# EAGLE design Light_node (EAGLE 7.5.0)
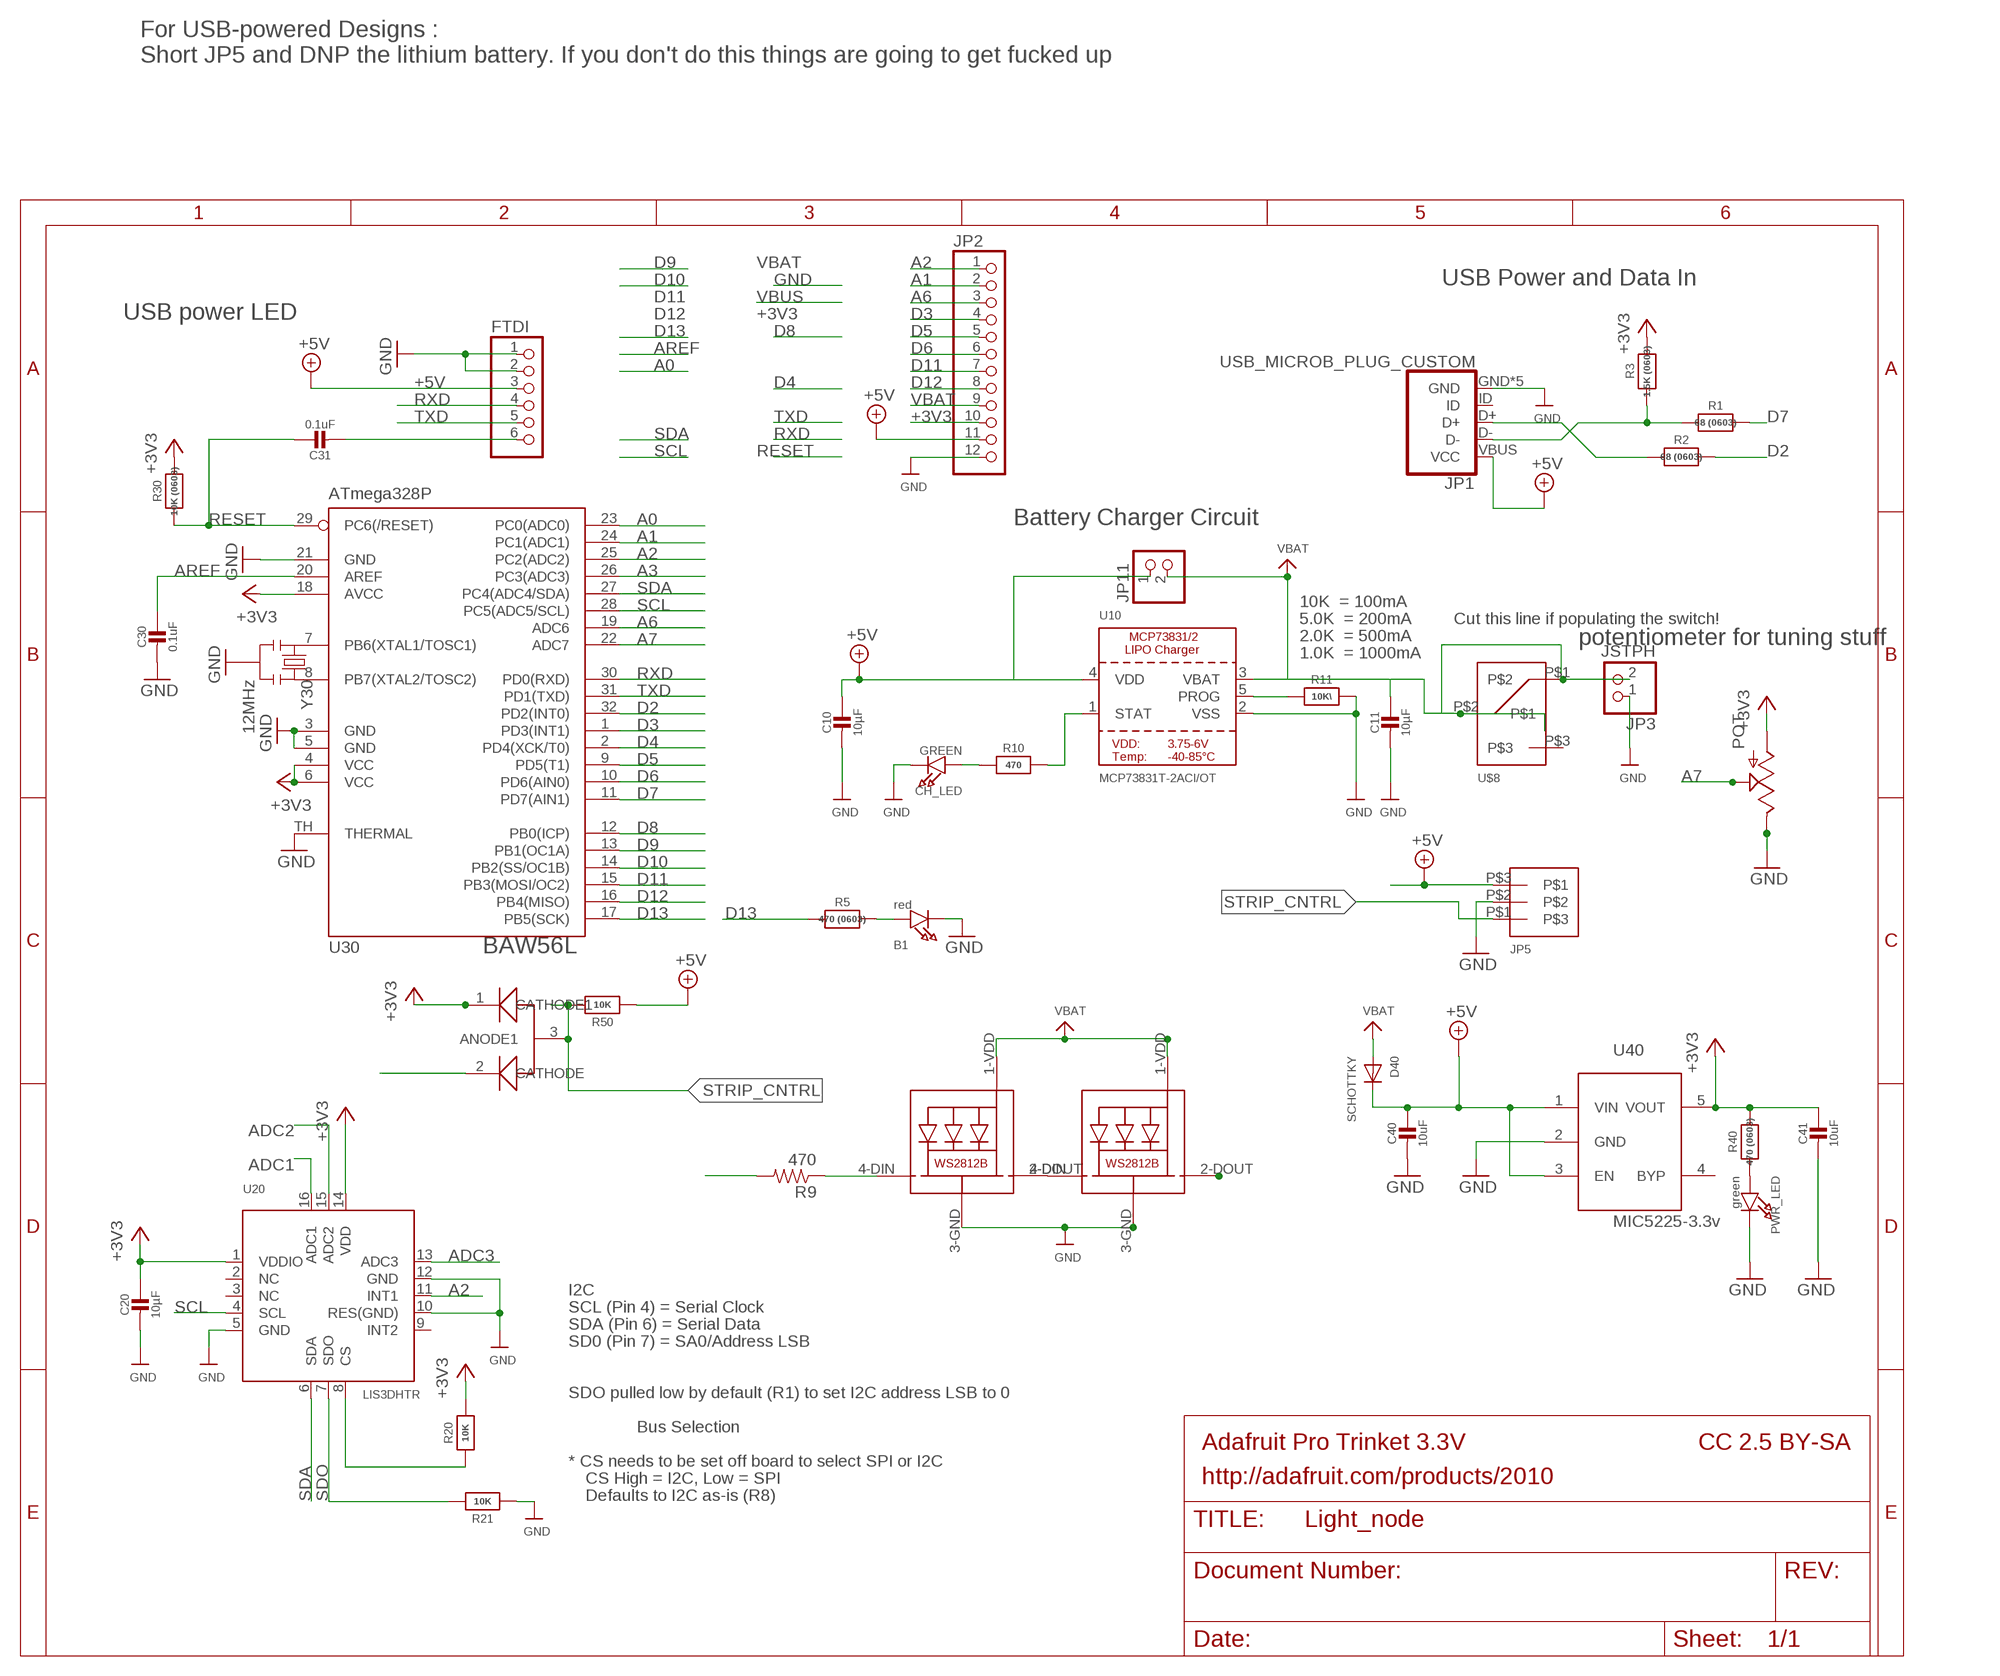
[diagram p0: schematic, sheet 1]

## Parts
B1  red  LED0805_NOOUTLINE  [CHIPLED_0805_NOOUTLINE]
C10  10µF  CAP_CERAMIC0805-NOOUTLINE  [0805-NO]
C11  10µF  CAP_CERAMIC0805-NOOUTLINE  [0805-NO]
C20  10µF  CAP_CERAMIC0805-NOOUTLINE  [0805-NO]
C30  0.1uF  CAP_CERAMIC_0805MP  [_0805MP]
C31  0.1uF  CAP_CERAMIC0805-NOOUTLINE  [0805-NO]
C40  10uF  CAP_CERAMIC0805-NOOUTLINE  [0805-NO]
C41  10uF  CAP_CERAMIC0805-NOOUTLINE  [0805-NO]
CH_LED  GREEN  LED0805_NOOUTLINE  [CHIPLED_0805_NOOUTLINE]
D40  SCHOTTKY  DIODE_SOD-123FL  [SOD-123FL]
FTDI  PINHD-1X6CB  [1X06-CLEANBIG]
JP1  USB_MICROB_PLUG_CUSTOM  [USB-MICROB]
JP2  PINHD-1X12-CB  [1X12-CB]
JP3  JSTPH  JST_2PIN  [JSTPH2]
JP5  M03  [M03_25MM]
JP11  HEADER-1X2ROUND  [1X02_ROUND]
POT  POT  [3306P_POT]
PWR_LED  green  LED0805_NOOUTLINE  [CHIPLED_0805_NOOUTLINE]
R1  68 (0603)  RESISTOR_0603_NOOUT  [0603-NO]
R2  68 (0603)  RESISTOR_0603_NOOUT  [0603-NO]
R3  1.5K (0603)  RESISTOR_0603_NOOUT  [0603-NO]
R5  470 (0603)  RESISTOR_0603_NOOUT  [0603-NO]
R9  470  RESISTOR0603-RES  [0603-RES]
R10  470  RESISTOR0805_NOOUTLINE  [0805-NO]
R11  10K\  RESISTOR0805_NOOUTLINE  [0805-NO]
R20  10K  RESISTOR0805_NOOUTLINE  [0805-NO]
R21  10K  RESISTOR0805_NOOUTLINE  [0805-NO]
R30  10K (0603)  RESISTOR0805_NOOUTLINE  [0805-NO]
R40  470 (0603)  RESISTOR_0603_NOOUT  [0603-NO]
R50  10K  RESISTOR_0603_NOOUT  [0603-NO]
RGB1  WS2812B5050  [WS2812B]
RGB2  WS2812B5050  [WS2812B]
U10  MCP73831T-2ACI/OT  MCP73831/2  [SOT23-5]
U20  LIS3DHTR  ACCEL_LIS3DHTR  [LGA16_3X3MM]
U30  ATmega328P  MEGA8-MI  [MLF32-TH]
U40  MIC5225-3.3v  LP298XS  [SOT23-5L]
U50  COMMON_ANODE_DIODE  [SOT23]
U$8  SPDT_NO_GNDSMT  [JS102011SAQN]
Y30  12MHz  RESONATORSMD  [RESONATOR-SMD]

## Nets
+3V3 [power]: C20.1 C41.1 JP2.10 POT.P$1(A) R3.2 R20.2 R30.2 R40.2 U20.1(VDDIO) U20.14(VDD) U30.4(VCC) U30.6(VCC) U30.18(AVCC) U40.5(VOUT) U50.1(CATHODE1)
+5V: C10.1 C40.1 D40.C FTDI.3 JP1.VBUS(VCC) JP2.11 JP5.P$3 JP11.1 R50.1 U10.4(VDD) U40.1(VIN) U40.3(EN)
A0: U30.23(PC0(ADC0))
A1: JP2.2 U30.24(PC1(ADC1))
A2: JP2.1 U20.11(INT1) U30.25(PC2(ADC2))
A3: U30.26(PC3(ADC3))
A6: JP2.3 U30.19(ADC6)
A7: POT.P$3(S) U30.22(ADC7)
ADC1: U20.16(ADC1)
ADC2: U20.15(ADC2)
ADC3: U20.13(ADC3)
AREF: C30.1 U30.20(AREF)
CS: R20.1 U20.8(CS)
D2: R2.2 U30.32(PD2(INT0))
D3: JP2.4 U30.1(PD3(INT1))
D4: U30.2(PD4(XCK/T0)) U50.2(CATHODE)
D5: JP2.5 U30.9(PD5(T1))
D6: JP2.6 U30.10(PD6(AIN0))
D7: R1.2 U30.11(PD7(AIN1))
D8: U30.12(PB0(ICP))
D9: U30.13(PB1(OC1A))
D10: R9.2 U30.14(PB2(SS/OC1B))
D11: JP2.7 U30.15(PB3(MOSI/OC2))
D12: JP2.8 U30.16(PB4(MISO))
D13: R5.2 U30.17(PB5(SCK))
D+: JP1.D+ R2.1
D-: JP1.D- R1.1 R3.1
DTR/RTS: C31.2 FTDI.6
GND [power]: B1.C C10.2 C11.2 C20.2 C30.2 C40.2 C41.2 CH_LED.C FTDI.1 FTDI.2 JP1.GND JP1.P$1(GND) JP1.P$2(GND) JP1.P$3(GND) JP1.P$4(GND) JP2.12 JP3.1 JP5.P$2 POT.P$2(E) PWR_LED.C R11.2 R21.1 RGB1.3-GND(GND) RGB2.3-GND(GND) U10.2(VSS) U20.5(GND) U20.10(RES(GND)) U20.12(GND) U30.3(GND) U30.5(GND) U30.21(GND) U30.TH(THERMAL) U40.2(GND) Y30.2
LED_CNTRL: R9.1 RGB1.4-DIN(DI)
N$1: B1.A R5.1
N$2: U30.8(PB7(XTAL2/TOSC2)) Y30.3
N$3: U30.7(PB6(XTAL1/TOSC1)) Y30.1
N$4: RGB1.2-DOUT(DO) RGB2.4-DIN(DI)
N$5: R10.2 U10.1(STAT)
N$6: PWR_LED.A R40.1
N$8: R11.1 U10.5(PROG)
N$9: CH_LED.A R10.1
N$15: RGB2.2-DOUT(DO)
RESET: C31.1 R30.1 U30.29(PC6(/RESET))
RXD: FTDI.4 U30.30(PD0(RXD))
SCL: U20.4(SCL) U30.28(PC5(ADC5/SCL))
SDA: U20.6(SDA) U30.27(PC4(ADC4/SDA))
SDO: R21.2 U20.7(SDO)
STRIP_CNTRL: JP5.P$1 R50.2 U50.3(ANODE1)
TXD: FTDI.5 U30.31(PD1(TXD))
VBAT [power]: C11.1 D40.A JP2.9 JP3.2 JP11.2 RGB1.1-VDD(VDD) RGB2.1-VDD(VDD) U10.3(VBAT) U$8.P$1 U$8.P$2
Unconnected: JP1.ID U20.2(NC) U20.3(NC) U20.9(INT2) U40.4(BYP) U$8.P$3

## Notes on the sheet
- For USB-powered Designs : 
  Short JP5 and DNP the lithium battery. If you don't do this things are going to get fucked up
- USB Power and Data In
- USB power LED
- Battery Charger Circuit
- 10K  = 100mA
- 5.0K  = 200mA | Cut this line if populating the switch!
- 2.0K  = 500mA | potentiometer for tuning stuff
- 1.0K  = 1000mA
- BAW56L
- I2C
- SCL (Pin 4) = Serial Clock
- SDA (Pin 6) = Serial Data
- SD0 (Pin 7) = SA0/Address LSB
- SDO pulled low by default (R1) to set I2C address LSB to 0
- Bus Selection
- Adafruit Pro Trinket 3.3V | CC 2.5 BY-SA
- * CS needs to be set off board to select SPI or I2C
- CS High = I2C, Low = SPI | http://adafruit.com/products/2010
- Defaults to I2C as-is (R8)

## Library data of the parts
B1 CH_LED PWR_LED = microbuilder:LED: LED 0603 - 0603 Surface Mount Package 2mA: Green LED - Low Power (3.9mcd, 2ma, 1.7Vf) - Digikey: 475-2709-2-ND Orange LED - Low Power (9.8mcd, 2ma, 1.8Vf) - Digikey: 475-1194-2-ND Red LED - Low Power (5mcd, 2ma, 1.8Vf) - Digikey: 475-1195-2-ND Yellow LED - Low Power (7mcd, 2ma, 1.8Vf) - Digikey: 475-1196-2-ND 5mA: Blue LED - Low Power (17mcd, 5ma, 2.9Vf) - Digikey: LNJ937W8CRACT-ND 0805 - 0805 Surface Mount Package 2mA: Red LED (8.8mcd, 2mA, 1.8Vf, Clear) - Low Power [Digikey: 475-2510-1-ND] Green LED (5mcd, 2mA, 1.8Vf, Clear) - Low Power [Digikey: 475-2730-1-ND] Yellow LED (11.3mcd, 2mA, 1.8Vf, Clear) - Low Power [Digikey: 475-2555-1-ND] 20mA: Red LED (104mcd, 20mA, Diffused) - LS R976 [Digikey: 475-1278-6-ND] Red LED (12mcd, 20mA, 2.0Vf, Clear) - APT2012EC [Digikey: 754-1128-1-ND] Green LED (15mcd, 20mA, 2.2Vf, Clear) - APT2012GC [Digikey: 754-1131-1-ND] Orange LED (160mcd, 20mA, 2.1Vf, Clear) - APT2012SECK [Digikey: 754-1130-1-ND] 1206 - 1206 Surface Mount Package Green LED (26mcd, 20mA, Diffused) - LG N971 [Digikey: 475-1407-6-ND] Red LED (15mcd, 20mA, Diffused) - LH N974 [Digikey: 475-1416-6-ND] Cree - Cree High-Power Surface Mount LEDs XPEBWT-L1-0000-00D50 - White 111lm 350mA 2.9Vf 6200K 110° XTEAWT-00-0000-00000LEE3 - White 114lm 350mA 2.85Vf 5000K 115° Everlight - Everlight 45-21 Series Surface Mount LEDs 45-21/QK2C-B2832AC2CB2/2T - Warm White 2000mcd 20mA 3.25Vf 3050K 120° 45-21/LK2C-B38452C4CB2/2T - Nuetral White 2000mcd 20mA 3.25Vf 4150K 120° 45-21/LK2C-B50634C6CB2/2T - Cold White 2200mcd 20mA 3.25Vf 5650K 120° PLCC2 Reverse Mount LS T77K-J1L2-1-0-2-R18-Z - Red 11.25mcd 2mA 1.8Vf 630nm 120° LO T77K-L1M2-24-Z - Orange 19.6mcd 2mA 1.8Vf 606nm 120° LY T77K-K2M1-26-Z - Yellow 15.7mcd 2mA 1.8Vf 587nm 120°
C10 C11 C20 C30 C31 C40 C41 = microbuilder:CAP_CERAMIC: Ceramic Capacitors For new designs, use the packages preceded by an '_' character since they are more reliable: The following footprints should be used on most boards: _0402 - Standard footprint for regular board layouts _0603 - Standard footprint for regular board layouts _0805 - Standard footprint for regular board layouts _1206 - Standard footprint for regular board layouts For extremely tight-pitch boards where space is at a premium, the following 'micro-pitch' footprints can be used (smaller pads, no silkscreen outline, etc.): _0402MP - Micro-pitch footprint for very dense/compact boards _0603MP - Micro-pitch footprint for very dense/compact boards _0805MP - Micro-pitch footprint for very dense/compact boards _1206MP - Micro-pitch footprint for very dense/compact boards
D40 = adafruit:DIODE: Diode SMADIODE - SMA Surface Mount Package 20V 1A Schottky Diode Digikey: 641-1014-6-ND DO-1N4148 - Through Hole Small Current Diode SOD-123 20V 1 A (.5mV Vf) Schottky Diode - Digikey: MBRX120TPMSCT-ND SOD-323 10V 570mA (.38mV Vf, 3ns) Schottky Diode - Digikey: ZLLS410CT-ND SOD-523 30V 30mA Schottky Diode (RB751S-40TE61) - Digikey: RB751S-40TE61CT-ND SOT23-R/W - SOT23 Package (R = Solder Paste/Reflow Ovens, W = Hand-Soldering) BAT54Film 40V 300mA - Digikey: 497-7162-1-ND
FTDI = adafruit:PINHD-1X6: PIN HEADER
JP1 = 0_AlpineLabs:USB_MICROB_PLUG: USB Micro-B Plug Comes in a variety of packages. Check out Hirose's ZX-x0 line: http://www.hirose.co.jp/cataloge_hp/e24200011.pdf
JP2 = adafruit:PINHD-1X12: PIN HEADER
JP3 = microbuilder:JST_2PIN: JST 2-Pin Right-Angle Connector PH-Series - 4UConnector: 17311 SH-Series - 4UConnector: 07278
JP5 = 0_Shibbs1:M03
JP11 = microbuilder:HEADER-1X2: PIN HEADER
POT = 0_Shibbs1:POT
R1-R3 R5 R10 R11 R20 R21 R30 R40 R50 = microbuilder:RESISTOR: Resistors For new designs, use the packages preceded by an '_' character since they are more reliable: The following footprints should be used on most boards: _0402 - Standard footprint for regular board layouts _0603 - Standard footprint for regular board layouts _0805 - Standard footprint for regular board layouts _1206 - Standard footprint for regular board layouts For extremely tight-pitch boards where space is at a premium, the following 'micro-pitch' footprints can be used (smaller pads, no silkscreen outline, etc.): _0402MP - Micro-pitch footprint for very dense/compact boards _0603MP - Micro-pitch footprint for very dense/compact boards _0805MP - Micro-pitch footprint for very dense/compact boards _1206MP - Micro-pitch footprint for very dense/compact boards
R9 = 0_shibbs2:RESISTOR: Resistor Basic schematic elements and footprints for 0603, 1206, and PTH resistors.
RGB1 RGB2 = microbuilder:WS2812B5050
U10 = microbuilder:MCP73831/2: MCP73831/2 LIPO Charger VDD: 3.75 - 6V Temp -40 - 85°C Programmable Charge Rate: 15-500mA NOTE: STAT is a tri-state logic output on the MCP73831 and an open-drain output on the MCP73832. SOT23-5 with 4.2V output and tri-state logic on STAT = MCP73831T-2ACI/OT
U20 = microbuilder:ACCEL_LIS3DHTR: LIS3DHTR 3-Axis Accelerometer with I2C/SPI Interface VDD: 1.71-3.6V VDDIO: 1.71-VDD+0.1V Scale: +/-2g, 4g, 8g, 16g with 16--bit data output Temp:: -40°C - 85°C Mouser: 511-LIS3DHTR Digikey: 497-10613-1-ND
U30 = microbuilder:MEGA8-MI: MICROCONTROLLER 8 Kbytes FLASH, 1 kbytes SRAM, 512 bytes EEPROM, USART, 6-channel 10 bit ADC, 2-channel 8 bit ADC Pin compatible with Atmega48, ATMega88, ATMega168 Source: avr.lbr; MPN: ATMEGA88PA-MU; OC_FARNELL: 1715491; OC_NEWARK: 15R0272
U40 = adafruit:LP298X
U50 = 0_AlpineLabs:COMMON_ANODE_DIODE
U$8 = 0_Shibbs1:SPDT_NO_GND
Y30 = SparkFun:RESONATOR: Resonator Small SMD resonator. This is the itty bitty 10/20MHz resonators with built in caps. CSTCE10M0G55 and CSTCE20M0V53. Footprint has been reviewed closely but hasn't been tested yet.

## Net classes
1 power: width 0.305 mm

## Board
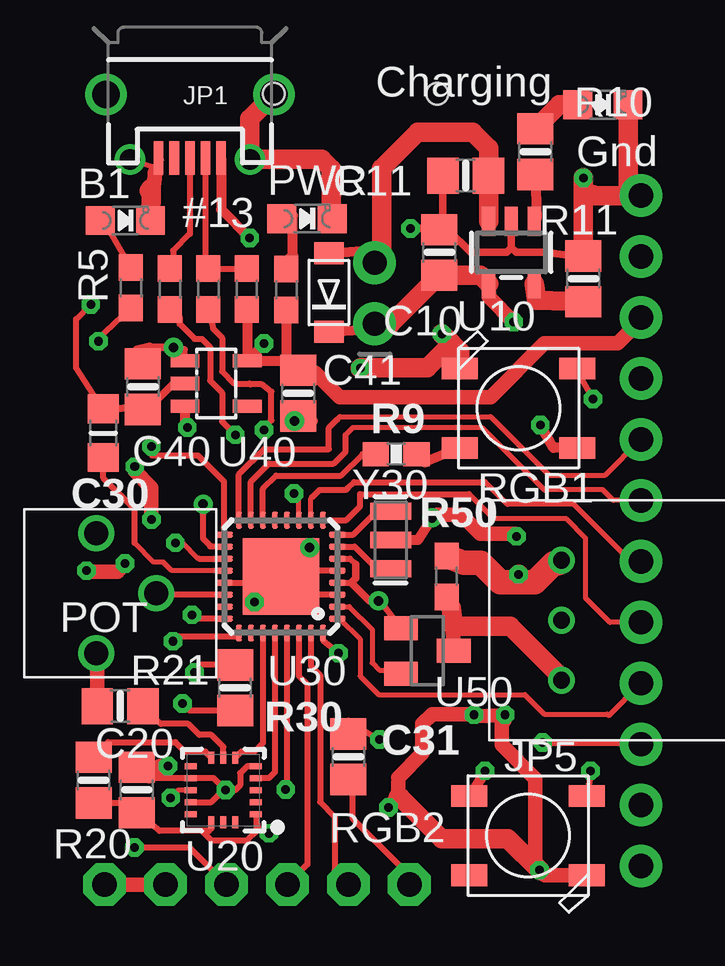
[diagram p1: board, top side]
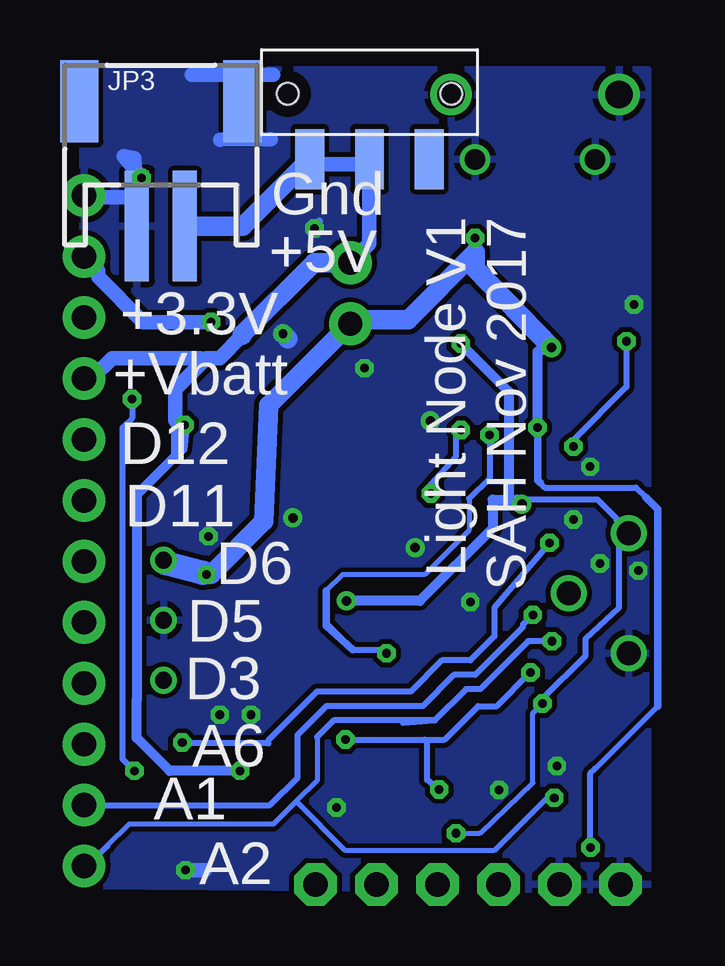
[diagram p2: board, bottom side, seen from below]

No outline drawn. Coordinates in mm, seen from the top.
Copper layers (1*16): Top 0.0178mm / dielectric 59mil / Bottom 0.0178mm
Design rules "SSC-EAGLE-2Lyr_v1.0.0.3 *": minimum track width 6mil, minimum drill 14mil, track to track 8mil, track to pad 8mil, pad to pad 8mil, via to via 8mil, smd to smd 6mil, copper to edge 20mil, drill to drill 16mil, minimum pad ring 8mil, minimum via ring 8mil, stop-mask expansion 3mil, vias tented up to drill 0mil, thermal gap 10mil

### Footprints (pad centres in the part's own frame; a part is rotated, then mirrored left to right if it is on the bottom)
CHIPLED_0805_NOOUTLINE = smd 1.2 x 1.2: A 0,-1.05; C 0,1.05
0805-NO = smd 1.3 x 1.5: 1 -0.95,0; 2 0.95,0
_0805MP = smd 1.2 x 1.3: 1 -1.016,0; 2 1.016,0
SOD-123FL = smd 0.91 x 1.22: A 1.637,0; C -1.637,0
1X06-CLEANBIG = drill 1.016 pad 1.778 octagon: 1 -6.35,0; 2 -3.81,0; 3 -1.27,0; 4 1.27,0; 5 3.81,0; 6 6.35,0
USB-MICROB = smd 0.4 x 1.4: D+ 0,2.65; D- -0.65,2.65; GND 1.3,2.65; ID 0.65,2.65; VBUS -1.3,2.65 | drill 1.15 pad 1.201: P$1 -3.5,0; P$2 3.5,0 | drill 0.85 pad 0.914: P$3 -2.5,2.7; P$4 2.5,2.7
1X12-CB = drill 1.016 pad 1.778: 1 -13.97,0; 2 -11.43,0; 3 -8.89,0; 4 -6.35,0; 5 -3.81,0; 6 -1.27,0; 7 1.27,0; 8 3.81,0; 9 6.35,0; 10 8.89,0; 11 11.43,0; 12 13.97,0
JSTPH2 = smd 1 x 4.6: 1 -1,-3.7; 2 1,-3.7 | smd 1.6 x 3.4: NC1 -3.4,1.5; NC2 3.4,1.5
M03_25MM = drill 0.7: P$1 0,-2.5; P$2 0,0; P$3 0,2.5
1X02_ROUND = drill 1 pad 1.778: 1 -1.27,0; 2 1.27,0
3306P_POT = drill 1: P$1 -2.5,0; P$2 2.5,0; P$3 0,2.5
0603-NO = smd 1.1 x 1: 1 -0.85,0; 2 0.85,0
0603-RES = smd 1.1 x 1: 1 -0.85,0; 2 0.85,0
WS2812B = smd 1.5 x 0.9: 1-VDD 2.45,-1.65; 2-DOUT 2.45,1.65; 3-GND -2.45,1.65; 4-DIN -2.45,-1.65
SOT23-5 = smd 0.55 x 1.2: 1 -0.95,-1.3; 2 0,-1.3; 3 0.95,-1.3; 4 0.95,1.3; 5 -0.95,1.3
LGA16_3X3MM = smd 0.5 x 0.25: 1 -1.35,1; 2 -1.35,0.5; 3 -1.35,0; 4 -1.35,-0.5; 5 -1.35,-1; 9 1.35,-1; 10 1.35,-0.5; 11 1.35,0; 12 1.35,0.5; 13 1.35,1 | smd 0.25 x 0.5: 6 -0.5,-1.35; 7 0,-1.35; 8 0.5,-1.35; 14 0.5,1.35; 15 0,1.35; 16 -0.5,1.35
MLF32-TH = smd 0.7 x 0.25: 1 -2.35,1.75; 2 -2.35,1.25; 3 -2.35,0.75; 4 -2.35,0.25; 5 -2.35,-0.25; 6 -2.35,-0.75; 7 -2.35,-1.25; 8 -2.35,-1.75; 17 2.35,-1.75; 18 2.35,-1.25; 19 2.35,-0.75; 20 2.35,-0.25; 21 2.35,0.25; 22 2.35,0.75; 23 2.35,1.25; 24 2.35,1.75 | smd 0.25 x 0.7: 9 -1.75,-2.35; 10 -1.25,-2.35; 11 -0.75,-2.35; 12 -0.25,-2.35; 13 0.25,-2.35; 14 0.75,-2.35; 15 1.25,-2.35; 16 1.75,-2.35; 25 1.75,2.35; 26 1.25,2.35; 27 0.75,2.35; 28 0.25,2.35; 29 -0.25,2.35; 30 -0.75,2.35; 31 -1.25,2.35; 32 -1.75,2.35 | smd 3.2 x 3.2: TH 0,0
SOT23-5L = smd 0.55 x 1.2: 1 -0.95,-1.3; 2 0,-1.3; 3 0.95,-1.3; 4 0.95,1.3; 5 -0.95,1.3
SOT23 = smd 1 x 1.4: 1 -0.95,-1.1; 2 0.95,-1.1; 3 0,1.1
JS102011SAQN = smd 1.2 x 2.5: P$1 2.489,2.794; P$2 0,2.794; P$3 -2.489,2.794 | hole 0.889: 3.404,0.064; -3.404,0.064
RESONATOR-SMD = smd 0.7 x 1.7: 1 -1.2,0; 2 0,0; 3 1.2,0

### Placement (x,y rotation side)
B1  3.01,29.15 270 top
C10  16.09,27.82 90 top
C11  17.19,31.02 180 top
C20  3.49,5.43 90 top
C30  2.09,20.3 90 top
C31  12.3,6.81 270 top
C40  3.75,22.23 270 top
C41  10.22,21.96 270 top
CH_LED  22.91,33.98 270 top
D40  11.49,26.15 90 top
FTDI  8.49,1.49 0 top
JP1  5.7,34.4 180 top
JP2  24.49,16.22 90 top
JP3  21.29,32.62 0 bottom
JP5  21.18,12.5 0 top
JP11  13.39,26.12 90 top
POT  1.79,13.62 270 top
PWR_LED  10.58,29.23 270 top
R1  6.47,26.3 270 top
R2  4.87,26.3 270 top
R3  8.06,26.3 270 top
R5  3.24,26.35 270 top
R9  14.29,19.42 180 top
R10  20.09,32.02 270 top
R11  22.09,26.72 90 top
R20  1.69,5.84 270 top
R21  2.79,8.92 0 top
R30  7.58,9.68 270 top
R40  9.72,26.27 270 top
R50  16.39,14.32 270 top
RGB1  19.39,21.33 0 top
RGB2  19.79,3.52 180 top
U10  19.09,27.82 180 top
U20  7.09,5.42 180 top
U30  9.49,14.32 180 top
U40  6.79,22.36 270 top
U50  15.59,11.22 270 top
U$8  12.6,34.5 180 bottom
Y30  14.07,15.84 90 top

### Tracks (layer width: path | path; a pad name or v marks a point on that pad's centre or on a via)
+3V3  (via drill 0.36, 0.39)
  Top 0.203: U20.1 8.54,3.87 v8.99,3.62 | U20.14 6.59,3.82
  Top 0.254: U30.18 6.55,15.57 6.55,15.6 6.25,15.9 v6.25,17.33 | U30.6 12.36,15.07 12.61,14.83 | U30.4 12.41,14.07 12.41,14.06 | R30.2 5.68,8.73 v5.39,9.02 | U50.1 13.89,12.97 v13.56,13.3 | 6.59,3.82 6.49,3.72 6.19,3.72 | 6.19,3.72 4.44,3.72 C20.1 3.08,4.88 R20.2 | 6.19,3.72 6.59,3.32 8.1,3.32 8.48,3.71 8.48,4.38 U20.1
  Top 0.305: 12.61,14.83 12.61,14.26 12.41,14.06 13.18,13.3 v13.56,13.3
  Top 0.406: 8.19,23.41 U40.5 | U40.5 9.69,23.31 | 9.69,23.31 C41.1 | R3.2 8.09,25.41 U40.5 | R40.2 9.72,23.33 9.69,23.31 | v8.79,24.02 8.79,24.01 U40.5
  Top 0.61: JP2.10 24.49,25 23.52,24.03 20.47,24.03 18.24,21.79 11.94,21.79 10.92,22.81 10.31,22.81 C41.1
  Bottom 0.203: v8.99,3.62 7.99,3.62 5.79,5.72 5.79,8.62 v5.39,9.02
  Bottom 0.254: v5.39,9.02 5.39,9.22 3.59,11.02 3.59,11.72 2.19,13.02 2.19,15.62 POT.P$1 2.29,16.62 2.29,16.72 3.09,17.52 6.06,17.52 v6.25,17.33 | 6.44,17.53 6.68,17.53 6.79,17.64
  Bottom 0.406: v8.79,24.02 6.79,22.02 6.79,17.64 | v6.25,17.33 6.44,17.53 7.47,17.53 7.47,16.33 10.5,13.3 v13.55,13.3 v13.56,13.3
+5V  (via drill 0.36, 0.39)
  Top 0.254: U40.1 5.49,23.79 v5.02,23.86 | v3.39,3.02 5.69,3.02 FTDI.3
  Top 0.305: C40.1 3.49,23.43 | 4.01,23.86 v5.02,23.86
  Top 0.406: 3.49,23.43 3.49,23.74 4.01,23.86 | D40.C 13.15,24.61 JP11.1 | U40.3 5.49,20.62 v5.59,20.52 | JP1.VBUS 7,29.62 v8.19,28.42
  Top 0.61: U10.4 18.14,25.97 v19.19,24.92
  Top 0.813: JP11.1 14.07,24.85 C10.1 17.79,26.87 U10.4 | 19.42,13.98 v19.39,14.41 | 21.06,14.87 JP5.P$3
  Top 1.016: 21.06,14.87 20.86,14.87 20.07,14.07 18.64,14.07 17.83,14.88 17.11,14.88 R50.1
  Bottom 0.203: 3.2,6.32 0.59,8.92
  Bottom 0.254: 5.02,24.09 v5.02,23.86 | 5.49,18.22 5.29,18.02 1.5,18.02 1.09,17.61 | v3.39,3.02 3.39,6.12 3.2,6.32
  Bottom 0.305: v5.59,20.52 5.59,18.32 5.49,18.22 | 1.09,17.61 0.59,17.11 0.59,8.92
  Bottom 0.406: v8.19,28.42 8.19,27.82 | 13.22,25.02 JP11.1 | v5.59,20.52 5.59,23.68 v5.02,23.86
  Bottom 0.61: 24.46,27.69 JP2.11 23.9,27.06 23.9,26.8 22.02,24.92 v19.19,24.92
  Bottom 0.813: JP11.1 16.79,21.45 17,16.61 19.2,14.41 v19.39,14.41 19.54,14.47 | 13.22,25.02 10.99,25.02 8.19,27.82 8.19,27.14 v5.02,23.86
  Bottom 1.016: 19.54,14.47 21.06,14.87 JP5.P$3
A1  (via drill 0.36)
  Top 0.254: U30.24 5.95,12.57 v5.79,12.72
  Bottom 0.254: v5.79,12.72 6.19,12.32 6.19,12.22 8.19,10.22 9.08,10.22 10.38,8.92 14.39,8.92 15.59,7.72 15.59,5.94 16.75,4.79 JP2.2
A2  (via drill 0.36)
  Top 0.203: U20.11 5.22,5.42 v4.9,5.1
  Top 0.254: U30.25 7.74,11.81 5.18,11.81 v4.99,11.62
  Bottom 0.203: 14.78,7.63 14.78,5.82 15.65,4.95 | 15.65,4.95 16.6,4 22.62,4 23.52,3.1 | v4.9,5.1 5.2,5.1 7.4,2.9 13.6,2.9 15.65,4.95
  Bottom 0.254: v4.99,11.62 5.99,11.62 7.99,9.62 8.57,9.62 9.87,8.32 | 11.19,8.22 9.87,8.32 | 9.87,8.32 14.09,8.32 14.78,7.63 | JP2.1 24.37,2.25 23.52,3.1
A6  (via drill 0.36)
  Top 0.203: U30.19 6.05,15.07 5.39,15.72 v5.09,15.72
  Top 0.254: 6.08,15.07 U30.19 | v20.4,7.4 24.43,7.4 JP2.3
  Bottom 0.254: v5.09,15.72 7.39,13.02 7.39,11.82 8.39,10.82 9.58,10.82 10.88,9.52 14.79,9.52 16.81,7.5 16.81,7.37 20.07,7.37 v20.4,7.4
A7
  Top 0.254: U30.22 4.35,13.57 POT.P$3
AREF
  Top 0.203: U30.20 4.95,14.57 4.59,14.92 4.19,14.92 3.39,15.72
  Top 0.254: C30.1 2.09,19.08 2.09,18.42 3.39,17.12 3.39,15.72
CS
  Top 0.254: 6.59,6.82 U20.8 6.34,7.02 5.49,7.02 5.09,7.42 2.29,7.42 2.29,7.22 2.19,7.12 2.19,6.47 R20.1
D2  (via drill 0.36)
  Top 0.254: R2.2 5.27,25.15 5.27,24.85 5.89,24.22 6.2,24.22 6.54,23.88 6.54,22.48 7.05,21.98 7.05,20.77 v7.59,20.22 | U30.32 11.24,11.67 v11.89,11.12
  Bottom 0.203: 8.45,17.57 8.45,16.25 10.3,14.4 13.72,14.4 14.39,13.72
  Bottom 0.254: 14.32,12.29 13.3,11.27 12.04,11.27 v11.89,11.12 | v7.59,20.22 7.59,18.42 8.45,17.57
  Bottom 0.305: 14.39,13.72 14.39,12.26 13.3,11.27
D3
  Top 0.203: U30.1 11.95,12.57 12.79,11.72 12.79,10.17 13.56,9.4 19.66,9.4 20.47,8.59 23.08,8.59 23.14,8.52 JP2.4
D4
  Top 0.203: U30.2 12.35,13.07 13.29,12.12 13.29,10.72 13.59,10.42 14.44,10.42 U50.2
D5
  Top 0.203: JP2.5 23.2,12.41 22.19,13.42 22.19,15.92 21.39,16.72 18.36,16.72 17.34,17.75
  Top 0.254: U30.9 12.22,16.67 12.8,17.24 12.8,17.75 17.34,17.75
D6
  Top 0.203: JP2.6 24.06,14.95 21.69,17.32 18.93,17.32 18,18.26 | U30.10 10.74,17.57 10.79,17.62
  Top 0.254: 18,18.26 12.54,18.26 12.29,18 12.27,18 12.19,17.92 11.09,17.92 10.79,17.62
D7  (via drill 0.36)
  Top 0.203: U30.11 10.24,17.57 v10.04,17.77
  Top 0.254: R1.2 6.67,24.64 7.05,24.26 7.05,22.87 7.56,22.36 8.19,22.36 8.23,22.32 8.69,22.32 9.09,22.02 9.09,20.82 v8.79,20.42
  Bottom 0.254: v10.04,17.77 10.04,18.17 8.99,19.32 8.99,20.42 v8.79,20.42
D10
  Top 0.254: U30.14 8.74,17.97 9.29,18.52 11.99,18.52 12.89,19.42 R9.2
D11
  Top 0.203: JP2.7 23.35,17.49 22.91,17.93 20.47,17.93 17.88,20.52 12.49,20.52 12.19,20.22
  Top 0.254: U30.15 8.24,18.27 8.99,19.02 11.69,19.02 12.19,19.52 12.19,20.22
D12
  Top 0.203: 11.84,20.87 11.95,20.98 18.24,20.98 20.67,18.54 23,18.54 JP2.8
  Top 0.254: U30.16 7.74,18.57 8.79,19.62 11.49,19.62 11.49,20.52 11.84,20.87
D13  (via drill 0.36)
  Top 0.254: U30.17 7.14,16.29 7.13,16.29 7.13,18.27 6.04,19.36 4.13,19.36 v4.09,19.73 | R5.2 1.84,24.18 v1.89,24.12
  Bottom 0.254: v1.89,24.12 1.89,22.22 4.09,20.02 v4.09,19.73
D+
  Top 0.254: JP1.D+ 5.7,28.6 5,27.9 5,27.28 R2.1
D-
  Top 0.254: R3.1 R1.1 6.35,27.26 JP1.D-
DTR/RTS
  Top 0.254: FTDI.6 14.84,1.87 12.49,4.22 12.49,5.67 C31.2
GND  (via drill 0.36, 0.39)
  Top 0.203: 4.14,5.92 4.29,5.92 v4.79,6.42 | JP1.P$4 4.3,31.34 4.16,31.2
  Top 0.254: U30.5 9.74,14.57 | U30.3 10.24,13.57 | U30.21 9.24,14.07 | U20.12 6.59,4.92 7.09,5.42 7.09,5.52 | 7.09,5.52 6.69,5.92 U20.10 4.14,5.92 C20.2 | U20.5 8.09,6.42 7.79,6.12 7.79,5.62 7.59,5.42 v7.19,5.42 7.09,5.52 | C30.2 1.86,21.61 0.96,23.01 0.96,25.05 v1.57,25.65
  Top 0.305: 9.24,14.07 v10.69,15.52 | 9.74,14.57 v10.69,15.52 | 10.24,13.57 v10.69,15.52 | C30.2 3.69,21.34 C40.2 4.06,21.6 4.25,21.6 5.02,22.36 U40.2 | U10.2 19.09,28.02 | 19.09,28.02 19.29,27.82 20.49,27.82 21.29,27.72 21.84,27.82 | C10.2 16.44,28.77 17.39,27.82 18.89,27.82 19.09,28.02 | C11.2 16.24,28.92 C10.2 | C10.2 16.09,28.82 v14.89,28.82
  Top 0.406: Y30.2 15.21,15.84 v15.79,16.76 | B1.C 4.16,31.2 | C41.2 10.82,20.8 v10.06,20.8 | JP1.GND 4.3,30.7 4,30.4
  Top 0.61: R21.1 1.84,11.07 POT.P$2 | RGB2.3-GND 20.48,1.87 v20.27,2.08 | v3,14.86 2.93,14.76 2.69,14.52 1.53,14.52 v1.4,14.56 | 14.38,5.94 15.39,6.96 15.39,8.18 15.8,8.59 17.51,8.59 v17.54,8.56 17.59,8.5 arc45 17.6,8.5 18.87,8.53 | 14.38,5.74 14.38,5.13 14.04,4.79 v13.98,4.7 | v19.3,15.99 19.3,16.05 19.25,16.1 17.8,16.1 17,16.9 16,16.9 15.8,16.7 | 3.39,18.82 3.39,18.72 4.09,18.02 4.09,16.71 | 4.09,16.71 4.09,16.62 | v4.1,16.7 4.09,16.71 | 4.62,1.47 2.16,1.47 FTDI.1 | v4.79,6.42 4.42,6.42 4,6 | PWR_LED.C 11.63,30.57 | 22.11,30.23 22.5,30.23 24,30.23 24.21,30.23 | 20.2,2.2 20.19,2.21 arc-45 20.1,2.43 20.1,5.9 18.7,7.3 18.7,8.09 arc-45 18.79,8.31 v18.84,8.56
  Top 0.813: RGB1.3-GND 16.94,23.7 16.61,24.03 | 16.61,24.03 v16.2,24.43 | v12.81,23 12.82,23.01 15.59,23.01 16.61,24.03 | 14.38,5.13 14.47,5.13 16.2,3.4 18.95,3.4 v20.27,2.08 | 4,30.4 4.1,30.49 B1.C | v22.09,30.93 R11.2 | JP2.12 22.54,30.19 22.5,30.23 | CH_LED.C 23.96,30.27 24,30.23 | PWR_LED.C 11.6,29.26 11.6,31.3 11.2,31.7 JP1.P$3 8.2,33.4 JP1.P$1
  Top 1.016: 9.74,14.57 U30.TH
  Bottom 0.203: 4.79,2.05 4.62,1.88
  Bottom 0.254: v1.57,25.65 1.78,25.86
  Bottom 0.305: v14.89,28.82 14.99,28.82 14.69,29.12
  Bottom 0.61: v20.27,2.08 19.45,2.08 | v22.09,30.93 22.84,31.82 22.41,31.75 22.31,30.13 24.41,30.13 | 16.61,35.23 20.01,35.23 | 16.71,32.53 18.81,32.53
  Bottom 0.813: v16.2,24.43 16,24.23
  other vias: 8.4,13.26 3.4,18.9
  pour Bottom: 1.01,35.43 1.01,1.24 24.55,1.44 24.55,35.43
LED_CNTRL
  Top 0.406: RGB1.4-DIN 15.49,19.07 R9.1
N$1
  Top 0.254: R5.1 1.84,29.63 B1.A
N$2
  Top 0.254: U30.8 12.51,16.07 13.43,16.99 14.01,16.99 Y30.3
N$3
  Top 0.254: U30.7 12.56,15.57 13.49,14.64 Y30.1
N$4  (via drill 0.36)
  Top 0.254: RGB1.2-DOUT 21.94,22.67 v22.49,21.72 | v22.39,6.22 22.39,6.12 RGB2.4-DIN
  Bottom 0.254: v22.49,21.72 22.49,20.92 22.89,20.52 22.89,6.72 v22.39,6.22
N$5
  Top 0.406: R10.2 20.14,29.22 U10.1
N$6
  Top 0.406: R40.1 9.72,27.45 9.99,27.72 9.99,29.37 PWR_LED.A
N$8
  Top 0.813: U10.5 20.14,25.82 R11.1
N$9
  Top 0.813: CH_LED.A 21.1,33.98 R10.1
RESET  (via drill 0.36)
  Top 0.254: U30.29 9.74,5.19 v9.69,5.44 | R30.1 6.18,10.63 v5.89,10.32 | C31.1 12.3,8.31 v13.59,7.52
  Bottom 0.254: v9.69,5.44 10.19,5.85 10.19,7.41 10.31,7.52 | v13.59,7.52 10.31,7.52 | 10.31,7.52 9.47,7.52 8.07,8.92 7.29,8.92 v5.89,10.32
RXD
  Top 0.254: U30.30 10.24,10.17 10.59,9.82 10.59,2.32 FTDI.4
SCL
  Top 0.254: U30.28 9.24,6.17 8.99,5.92 U20.4
SDA
  Top 0.254: U30.27 8.74,7.37 8.39,7.02 7.84,7.02 U20.6
SDO
  Top 0.254: U20.7 7.09,7.22 6.59,7.72 6.09,7.72 5.64,8.18 4.49,8.18 R21.2
STRIP_CNTRL
  Top 0.406: R50.2 16.59,13.02
  Top 0.61: U50.3 16.69,11.42 16.59,13.02
  Top 0.813: JP5.P$1 21.3,10 19.05,12.24 16.67,12.24 16.59,13.02
TXD
  Top 0.254: 12.39,1.58 FTDI.5 11.73,2.06 11.73,4.32 11.12,4.93 11.12,10.21 10.74,10.59 U30.31
VBAT  (via drill 0.36)
  Top 0.406: D40.A 12.9,27.89 JP11.2 | RGB2.1-VDD 17.94,6.07 v17.99,6.22 | RGB1.1-VDD 20.85,19.68 v20.3,20.64
  Top 0.813: JP11.2 13.69,27.69 13.69,31.32 15.19,32.82 17.49,32.82 18.14,32.17 C11.1 U10.3
  Bottom 0.406: 20.69,20.82 20.67,20.8 20.67,19.34 | 20.67,19.34 22.29,17.72 22.29,9.19 22.3,9.18 22.3,7.6 20.92,6.22 v17.99,6.22 | v20.3,20.64 20.39,19.62 20.67,19.34
  Bottom 0.61: 13.49,27.49 JP11.2 12.6,28.19 12.6,31.5 | 20.69,20.82 20.69,22.12 19.53,23.29 | JP2.9 24.16,22.57 23.32,23.42 19.66,23.42 19.53,23.29 | 17.89,24.37 18.85,23.42 19.4,23.42 19.53,23.29 | U$8.P$2 12.6,31.5 | 12.6,31.5 15,31.5 arc-45 U$8.P$1
  Bottom 0.813: 12.89,27.39 13,27.79 JP11.2 14.9,27.4 17.89,24.41 17.89,24.37 | JP3.2 17.87,28.92 U$8.P$1

### Text on the board
tPlace: Charging | Gnd | PWR | #13
bPlace: USBtinyISP / or UNO FTDI / Bootloader
bNames: Light Node V1 / SAH Nov 2017 | Gnd | +5V | +3.3V | +Vbatt | D12 | D11 | D6 | D5 | D3 | A6 | A1 | A2